# Altium schematic sheet 1_viper_eagle_rep_top.SchDoc: =ProjectTitle
size A4; Address1: github.com/4pplet/eagle_viper; Address2: Licence: CERN-OHL-S; Address4: www.4pplet.com; SheetNumber: 1; SheetTotal: 5; ProjectName: waffling60
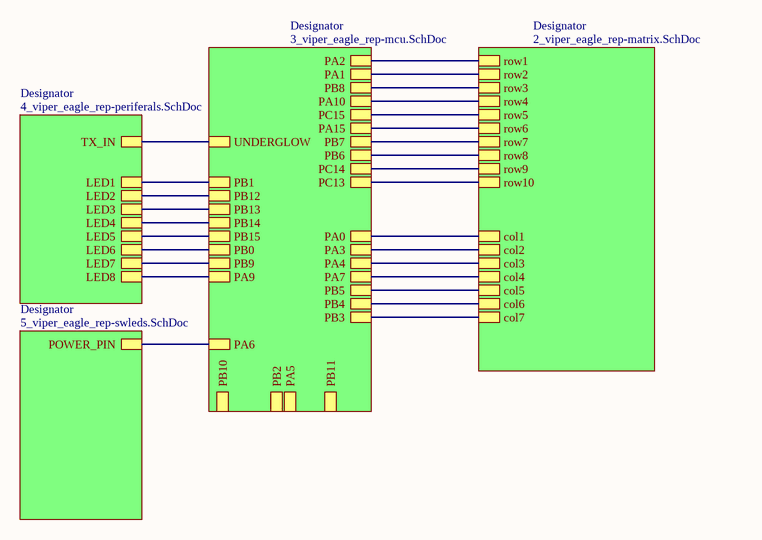
[diagram p0: 1_viper_eagle_rep_top.SchDoc]

## Sub-sheets
Designator = 3_viper_eagle_rep-mcu.SchDoc: PB10, PB3, PB2, PB9, PB0, PB7, PA15, PB6, PC14, PB13, UNDERGLOW, PB12, PB11, PA0, PA6, PC15, PB1, PB4, PA10, PC13, PB5, PB14, PA9, PA1, PA2, PB15, PB8, PA4, PA3, PA5, PA7
Designator = 2_viper_eagle_rep-matrix.SchDoc: col5, col7, col3, col1, row3, row1, row4, row2, row5, col4, col2, col6, row9, row7, row6, row8, row10
Designator = 4_viper_eagle_rep-periferals.SchDoc: TX_IN, LED4, LED7, LED3, LED5, LED1, LED6, LED8, LED2
Designator = 5_viper_eagle_rep-swleds.SchDoc: POWER_PIN

## Nets
(unnamed): sheet Designator/PB3, sheet Designator/col7
(unnamed): sheet Designator/PB9, sheet Designator/LED7
(unnamed): sheet Designator/PB0, sheet Designator/LED6
(unnamed): sheet Designator/PB7, sheet Designator/row7
(unnamed): sheet Designator/PA15, sheet Designator/row6
(unnamed): sheet Designator/PB6, sheet Designator/row8
(unnamed): sheet Designator/PC14, sheet Designator/row9
(unnamed): sheet Designator/PB13, sheet Designator/LED3
(unnamed): sheet Designator/UNDERGLOW, sheet Designator/TX_IN
(unnamed): sheet Designator/PB12, sheet Designator/LED2
(unnamed): sheet Designator/PA0, sheet Designator/col1
(unnamed): sheet Designator/PA6, sheet Designator/POWER_PIN
(unnamed): sheet Designator/PC15, sheet Designator/row5
(unnamed): sheet Designator/PB1, sheet Designator/LED1
(unnamed): sheet Designator/PB4, sheet Designator/col6
(unnamed): sheet Designator/PA10, sheet Designator/row4
(unnamed): sheet Designator/PC13, sheet Designator/row10
(unnamed): sheet Designator/PB5, sheet Designator/col5
(unnamed): sheet Designator/PB14, sheet Designator/LED4
(unnamed): sheet Designator/PA9, sheet Designator/LED8
(unnamed): sheet Designator/PA1, sheet Designator/row2
(unnamed): sheet Designator/PA2, sheet Designator/row1
(unnamed): sheet Designator/PB15, sheet Designator/LED5
(unnamed): sheet Designator/PB8, sheet Designator/row3
(unnamed): sheet Designator/PA4, sheet Designator/col3
(unnamed): sheet Designator/PA3, sheet Designator/col2
(unnamed): sheet Designator/PA7, sheet Designator/col4

## Notes on the sheet
- Title
- Size:
- Date:
- A4
- Number:
- Time:
- Revision:
- Sheet
- of
- File: